# Altium schematic sheet sun_siphon.SchDoc
size C
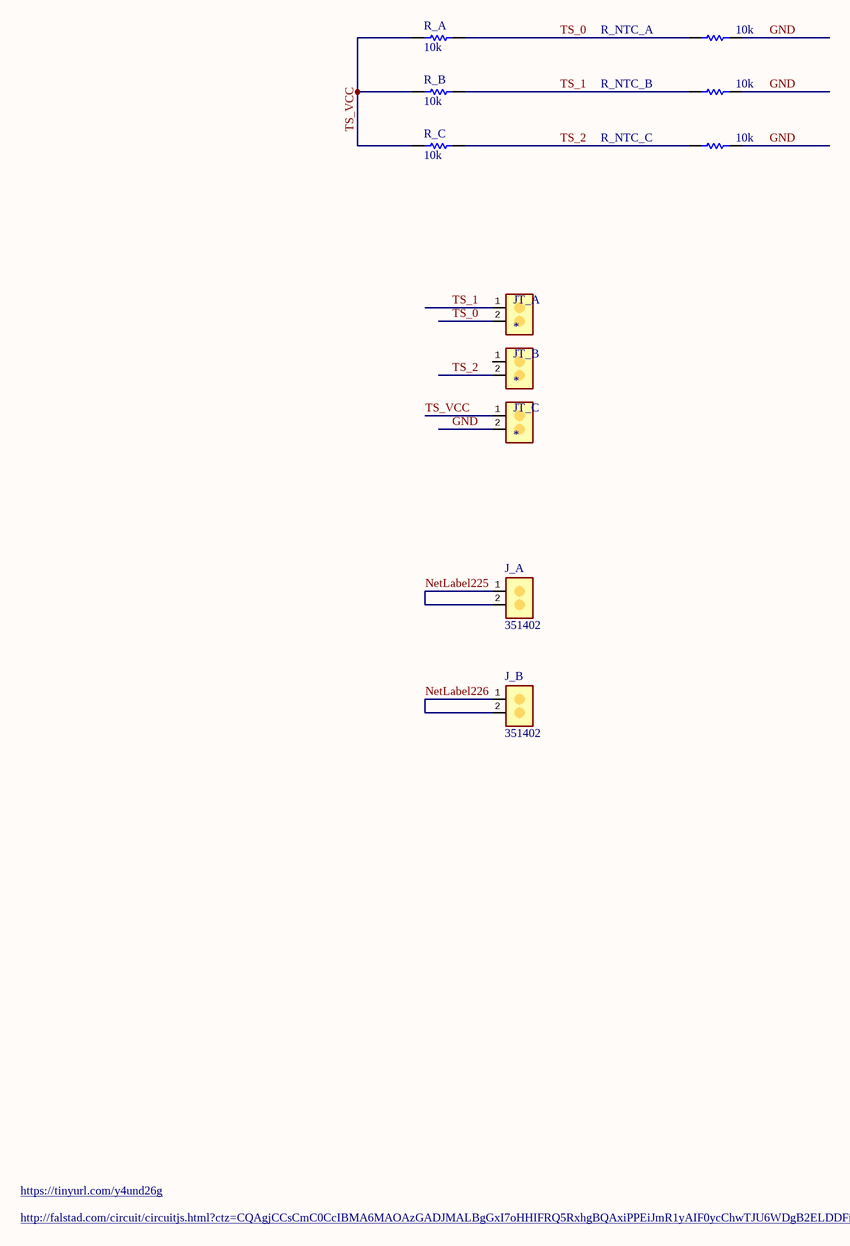
[diagram p0: sun_siphon.SchDoc]

## Parts
J_A  351402  [Adels-Contact_351402]
J_B  351402  [Adels-Contact_351402]
JT_A  *  [MOLEX_1041880210]
JT_B  *  [MOLEX_1041880210]
JT_C  *  [MOLEX_1041880210]
R_A  value 10k  [R_0402]  (hidden comment: 0402WGF1002TCE)
R_B  value 10k  [R_0402]  (hidden comment: 0402WGF1002TCE)
R_C  value 10k  [R_0402]  (hidden comment: 0402WGF1002TCE)
R_NTC_A  value 10k  [R_0402]  (hidden comment: NCP15XH103F03RC)
R_NTC_B  value 10k  [R_0402]  (hidden comment: NCP15XH103F03RC)
R_NTC_C  value 10k  [R_0402]  (hidden comment: NCP15XH103F03RC)

## Nets
GND: JT_C.2 R_NTC_A.1 R_NTC_B.1 R_NTC_C.1
NetLabel225: J_A.1 J_A.2
NetLabel226: J_B.1 J_B.2
TS_0: JT_A.2 R_A.2 R_NTC_A.2
TS_1: JT_A.1 R_B.2 R_NTC_B.2
TS_2: JT_B.2 R_C.2 R_NTC_C.2
TS_VCC: JT_C.1 R_A.1 R_B.1 R_C.1

Not connected (* = marked no-connect by the designer): JT_B 1

## Notes on the sheet
- https://tinyurl.com/y4und26g
- http://falstad.com/circuit/circuitjs.html?ctz=CQAgjCCsCmC0CcIBMA6MAOAzGADJMALBgGxI7oHHIFRQ5RxhgBQAxiPPEiJmR1yAIF0ycChwTJU6WDgB2ELDDFiKOesLpic9LqSRIIHOJwsA7hzDckujkOS2czC7gL0iVXJCoejz8Fb0mJDcTHyYmFROACaCxDT6PvHgclTc0dAAZgCGAK4ANgAuzABKIHJ8SG7lleRG9dVW9fTGkKU19CEiFZ3ELQ30Tf2tzPkB4ZHj9EgVosZSBAqwxvDYSEjwYBWuxGCbfoUgxLaJHcje9RCwBCiYut6cpjr6mEZqOMG66Db4pATr4AkIAyOQKxUOxxEvHoPR4fHoSnKKF2hEwEng3y2izecg+kC+P2UVQBuHoILyRWYENs+G4sNp4EZSmMHmEKhsKnQcngNGMuyQXmC8Dk3nI2kBZKyFPBR1sQm6fHlTIgYBQ+OCYAick1axwpDe-MFkGFoq0ClJwKlYP82m4SshgmEfgs6GUPBwNFSUI9yH8XriNFdSQSNtm9tmDKcFltUCaDsjfomVFhd15ifcvDOqb8AHMQEGeBR85nsy1Q9xobKofDy3D6DHTlGjrNTg7G+nkLMUz6m7CCPBk4rkk2eTRhPRNnb0GWXB6giFAVU687AdVfLgl0qR01jXbkru-GMvFQIp48GkW28FktjN9yJF-vobNr8H4ysfqINz8g6v1qpNhjVfwP3Xb9T0PKYeAXMJ3Ddbh5ikTgkOQlDOA4FAMUgPVIEfCpMAIfCV0nFJgxIvwACd8zdNFA2nd1eQlfx+x8J1KBoYJ4KY5JfGY5cnEIgAvAA3AB7IpshzaAAB0AEcwEMQY1FRLo9hschdEweR6lCBTmAEqiTyLAsaNEYSxMKCTpLktp9OMoy3TY0zRPEyTZPk5hKP9EyvKLL9JA88pjgDQKoV8iUJC4hILkcjiVzsz0gtLZg8zcTomlSqAbGaZLBCBU4MqqYYcuI7N0AHQsGKcPMY2zeIgjCmJAQuQqmovaxLVBSkLE4O0nQ3McnRHexx34XqRBHARK36vj-B65dRwccaApAt0YMEN0WnEdzKI-WK1tizbTDaWcLj2ucoM4iwvJ9bs0yuoLHL7YcAsgVJl1etJqmmMgnDKD7PygN6yHGgZwHg5ogIsf7Kxw9ia3YGq+GhypBHeaR0YkGBYCWVUbEIPUdDK17vjehDzEBliRH+kanEo-6ugpwQ6O+iKobepVYcdJaofsSteMrJtOaVXitzYZsxsZpU7TRjHpCx81bgMAgsL1KxuRw14yapfM6JMkqe0ZYxcWCORsD1XQeWFTXbgxD1iG8HQBxmHBEFJSVOplXR3GSYjHJVRRlEgZFXVWeADFxeAxRxMrjn0EmMUWH03Y66VtZ4ujfEjJl0BQLARWY0gVBUBTxAMZ91mVsVFn0CUU+tSiC0cr3gr8tO4LlOCLkGRRjC2GZUj7vYcHzrQrzLrlNR0PpI4LC1yWtbqmi2KhiJsbnBEzfLknbCxHIZAjuATRfD4EX3meYWJOb+KB7AbOvKViNaWqfy958pd9AgBp-f1BgCIbaHaGB2LQSAetKIdAAoxnDBWMKbtabiwqgggW4Umw1SLCmXywFP57VAQdLBipVqgN8PA9OsEfCZj8hFSivhwK+DXpcKQTFqKTBoQuJsrC7QOQoRfHgQVl7BX4ekK0XVeEiH4ZEKmQweESKgAIPeAghEe0irGPcY4NoBRkeIpOpNkA-XaCZQRth+F-kGODTabQ3CvEIDQA8JkYwThwAAfXQI4pxVgNhOL5Ooe29tIiRzuHHVxJhTCOKUI4pAjjI6OMwO0betht5d1BkMf+kDgHcDiSDOBAVTixVOPQyhThDiqVytMaKQJu6tHwK6IQGgcIYggHyYeuBlBWAkUIaCQI37FBcJNaCWUMqFLBiIDK3FylMngBhLA2AsL2zDmiJc8wtirD1MQPx-YXbKDEZ04R3SjhpL2Ygqq5wfBwTDBtCixyLrgF6eDROVCDl7SygdQQuJWaXOzDkoKTYZEMh+QIJwABnSwMCaC+0GvUHI+QAXQGAnIoEVgoRsJytxN03EKFvkufQvJiT3CmOaG8Y67yFwcL8ECkqfASoNRAJC6F2s+blT5sOZUqp1CmE4DhVISAVCUDeAKEgxp0DGjZd4b4tcuntE6PYWAmZOYmNoIBNoeZikjX4TTXMQyoB9A1f9MsZRaHJFoei3FYN8UjEOOVTmCKb4MQaciCITTIBolencbw1t7akgFDyLlXJ7aGDnjs7WwMBFyKZVcVoZUtgbJdjhQOChFncjRLiQghAZiWzFQGlw-T4VZQZoCpm1qOBUFlRC7IUKYWUUlWOKm9hKH+E+SIHJSL2AOXKlw8GsgEBXlMF2lgsQ97pX3Ao++xQdo5qyi1XNjELBBsci1Ry8C50Gp9POlB-gYaTSCgeJsi6EjVFzbCiWyrynMEIpkMw0RyIiQAA6yQQt2wYWlDoSCQJgDEkIrCRyTdoEGjVRQIL-XVUQZ6L3XtvcE3t71JqKnKtwYDl6b0yTvSwSxZFOZ2J-pqMAjj4iuMcW4TgQT5KkEgEEiQRH9ChKwxEzD0SAoLRGsKItNbdERTzIxgt7G-1lkogteh7GWosyOfx6o-Gf6-UZgzemWq5XJPMcwES9RMkRHki81QGAQj-BCC+kUL7ZEoA2EQMg9snwPgUnMHgIASgAFEADKAB5AAcgAQQcwAFSkgCgAwk5gACvJ8AgZLjrEjvmXOZAiREGVneEUXbu0QBoIQCzmpLivFeAAcSc65qzHmbMAEk0vOYADI2f85mTJwX4simRMrTUXAVCqRYZgDCVhVlYCqNOHl7USwgB83ZgA6lZkoHncsOYACIAFVPOubsyUfz3J8z1FpK8QDVhc4WbpIgV4vWBtDYBdZvLNnpuzaAA

## Library data of the parts
J_A J_B = 351402: J - JACK - POWER - SMDflat 545/ 2 - RIGHT - MALE; LCSC Part #: X; JLC Availability: None
JT_A JT_B JT_C = 1041880210: J - JACK - POWER - MOLEX 1041880210; LCSC Part #: C565283; JLC Availability: Extended
R_A R_B R_C = 0402WGF1002TCE: R - RESISTOR - SMD - 10k - 1% - 0402; LCSC Part #: C25744; JLC Availability: Basic
R_NTC_A R_NTC_B R_NTC_C = NCP15XH103F03RC: RT - NTC THERMISTOR - 10k - 1% - 0402; Value2: 3380k; LCSC Part #: C77131; JLC Availability: Extended